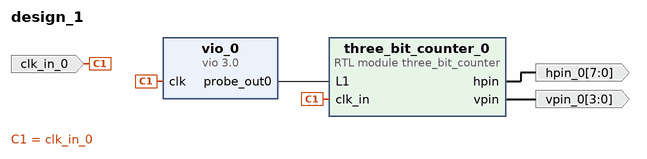
[diagram p0: block diagram of the top level]
# Vivado block design design_1, xc7z010clg400-1, Vivado 2023.2
create_bd_design design_1

create_bd_port -dir I clk_in_0
create_bd_port -dir O -from 7 -to 0 hpin_0
create_bd_port -dir O -from 3 -to 0 vpin_0

create_bd_cell -type module -reference three_bit_counter three_bit_counter_0
create_bd_cell -type ip -vlnv xilinx.com:ip:vio:3.0 vio_0
set_property -dict {CONFIG.C_NUM_PROBE_IN 0} [get_bd_cells vio_0]

# ---- connections ----

connect_bd_net -net clk_in_0_1 [get_bd_ports clk_in_0] [get_bd_pins vio_0/clk] [get_bd_pins three_bit_counter_0/clk_in]
connect_bd_net [get_bd_pins three_bit_counter_0/hpin] [get_bd_ports hpin_0]
connect_bd_net [get_bd_pins three_bit_counter_0/vpin] [get_bd_ports vpin_0]
connect_bd_net [get_bd_pins vio_0/probe_out0] [get_bd_pins three_bit_counter_0/L1]

validate_bd_design
save_bd_design
